# EAGLE design Soil Power Sensor (EAGLE 9.6.2)
REVISION: 2.0.0-a.6

## Sheet 1 of 4
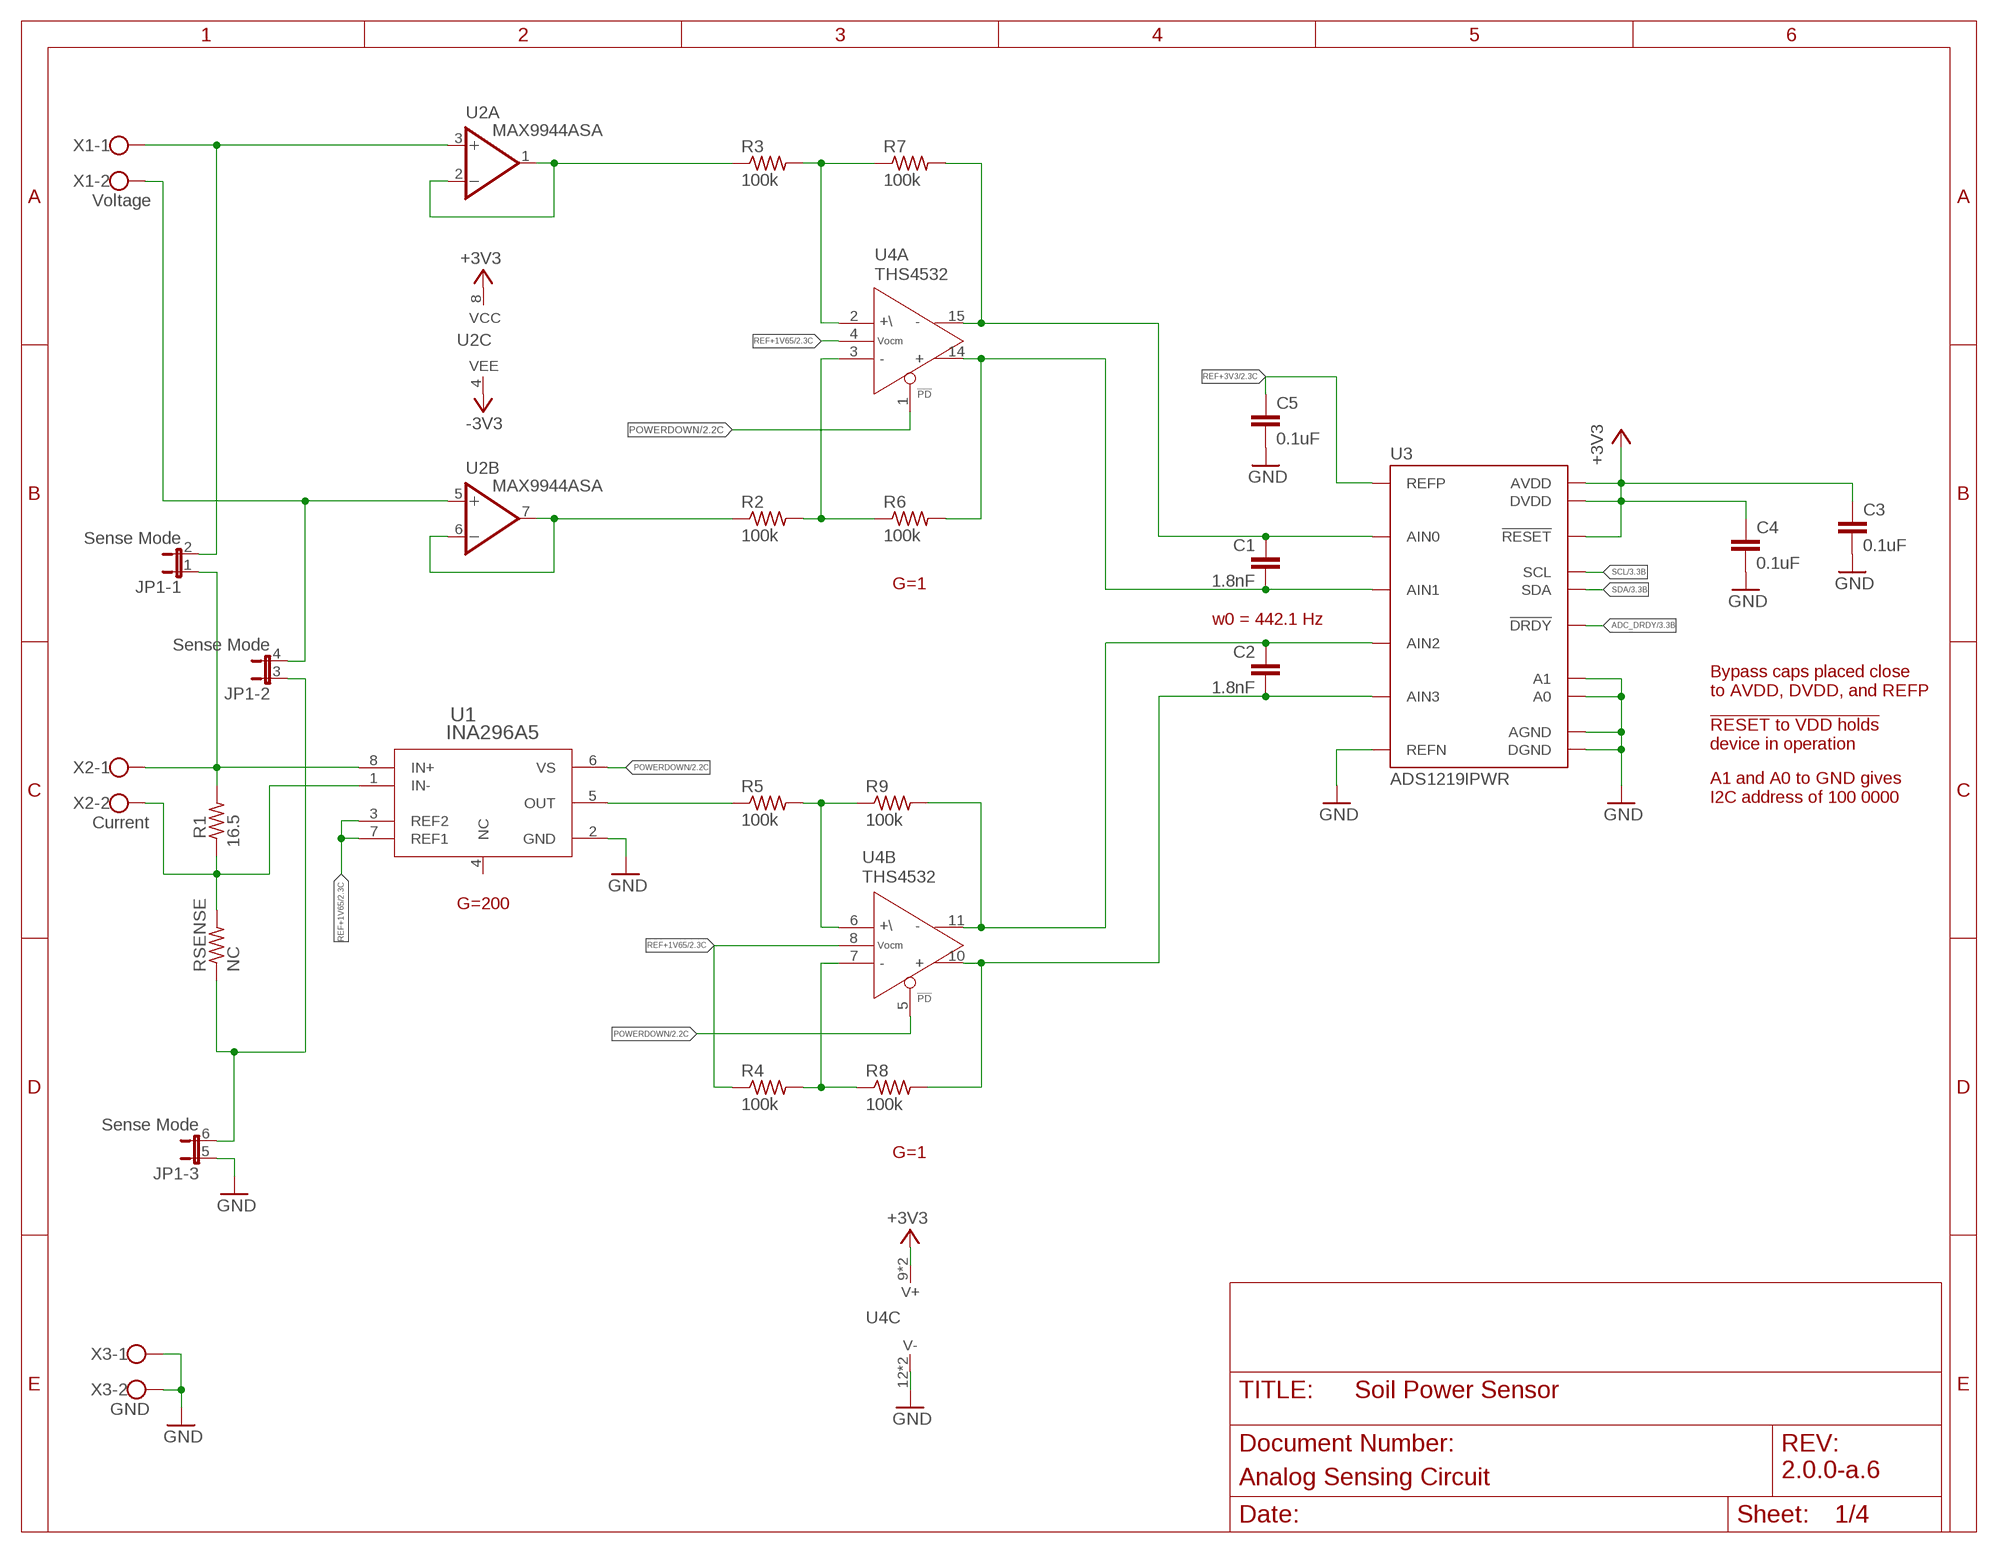
[diagram p0: schematic, sheet 1]

### Parts
C1  1.8nF  C-EUC0603  [C0603]
C2  1.8nF  C-EUC0603  [C0603]
C3  0.1uF  C-EUC0603  [C0603]
C4  0.1uF  C-EUC0603  [C0603]
C5  0.1uF  C-EUC0603  [C0603]
JP1  Sense Mode  JP3QE  [JP3Q]
R1  16.5  R-US_R0603  [R0603]
R2  100k  R-US_R0603  [R0603]
R3  100k  R-US_R0603  [R0603]
R4  100k  R-US_R0603  [R0603]
R5  100k  R-US_R0603  [R0603]
R6  100k  R-US_R0603  [R0603]
R7  100k  R-US_R0603  [R0603]
R8  100k  R-US_R0603  [R0603]
R9  100k  R-US_R0603  [R0603]
RSENSE  NC  R-US_R0603  [R0603]
U1  INA296A5  [SOT65P280X110-8N]
U2  MAX9944ASA  [SOIC127P600X155-8N]
U3  ADS1219IPWR  [TSSOP65P640X120-16]
U4  THS4532  [SOP65P640X120-16N]
X1  Voltage  W237-102  [W237-102]
X2  Current  W237-102  [W237-102]
X3  GND  W237-102  [W237-102]

### Nets
+3V3: C3.1 C4.1 U2.8(C:VCC) U3.PIN3(!RESET) U3.PIN12(AVDD) U3.PIN13(DVDD) U4.9(C:V+) U4.13(C:V+) ; also sheet 2,3,4
-3V3: U2.4(C:VEE) ; also sheet 2
ADC_DRDY: U3.PIN14(!DRDY) ; also sheet 3
CURRENT_N: C2.1 R9.2 U3.PIN7(AIN2) U4.11(B:OUT-)
CURRENT_P: C2.2 R8.2 U3.PIN6(AIN3) U4.10(B:OUT+)
GND: C3.2 C4.2 C5.2 JP1.5 U1.2(GND) U3.PIN1(A0) U3.PIN2(A1) U3.PIN4(DGND) U3.PIN5(AGND) U3.PIN8(REFN) U4.12(C:V-) U4.16(C:V-) X3.1 X3.2 ; also sheet 2,3,4
I+: JP1.1 R1.2 U1.8(IN+) X2.1
I-: R1.1 RSENSE.2 U1.1(IN-) X2.2
N$4: R2.1 U2.6(B:-IN) U2.7(B:OUT)
N$8: R3.1 U2.1(A:OUT) U2.2(A:-IN)
N$29: R3.2 R7.1 U4.2(A:+IN)
N$30: R2.2 R6.1 U4.3(A:-IN)
N$33: R5.2 R9.1 U4.6(B:+IN)
N$36: R4.2 R8.1 U4.7(B:-IN)
N$37: R5.1 U1.5(OUT)
N$48: JP1.3 JP1.6 RSENSE.1
POWERDOWN: U1.6(VS) U4.1(A:!PD) U4.5(B:!PD) ; also sheet 2,3
REF+1V65: R4.1 U1.3(REF2) U1.7(REF1) U4.4(A:VOCM) U4.8(B:VOCM) ; also sheet 2
REF+3V3: C5.1 U3.PIN9(REFP) ; also sheet 2
SCL: U3.PIN16(SCL) ; also sheet 3,4
SDA: U3.PIN15(SDA) ; also sheet 3,4
V+: JP1.2 U2.3(A:+IN) X1.1
V-: JP1.4 U2.5(B:+IN) X1.2
VOLTAGE_N: C1.1 R7.2 U3.PIN11(AIN0) U4.15(A:OUT-)
VOLTAGE_P: C1.2 R6.2 U3.PIN10(AIN1) U4.14(A:OUT+)
Unconnected: U1.4(NC)

### Notes on the sheet
- G=1
- w0 = 442.1 Hz
- Bypass caps placed close
  to AVDD, DVDD, and REFP
- !RESET to VDD holds
  device in operation
- A1 and A0 to GND gives
  I2C address of 100 0000
- G=200
- G=1

## Sheet 2 of 4
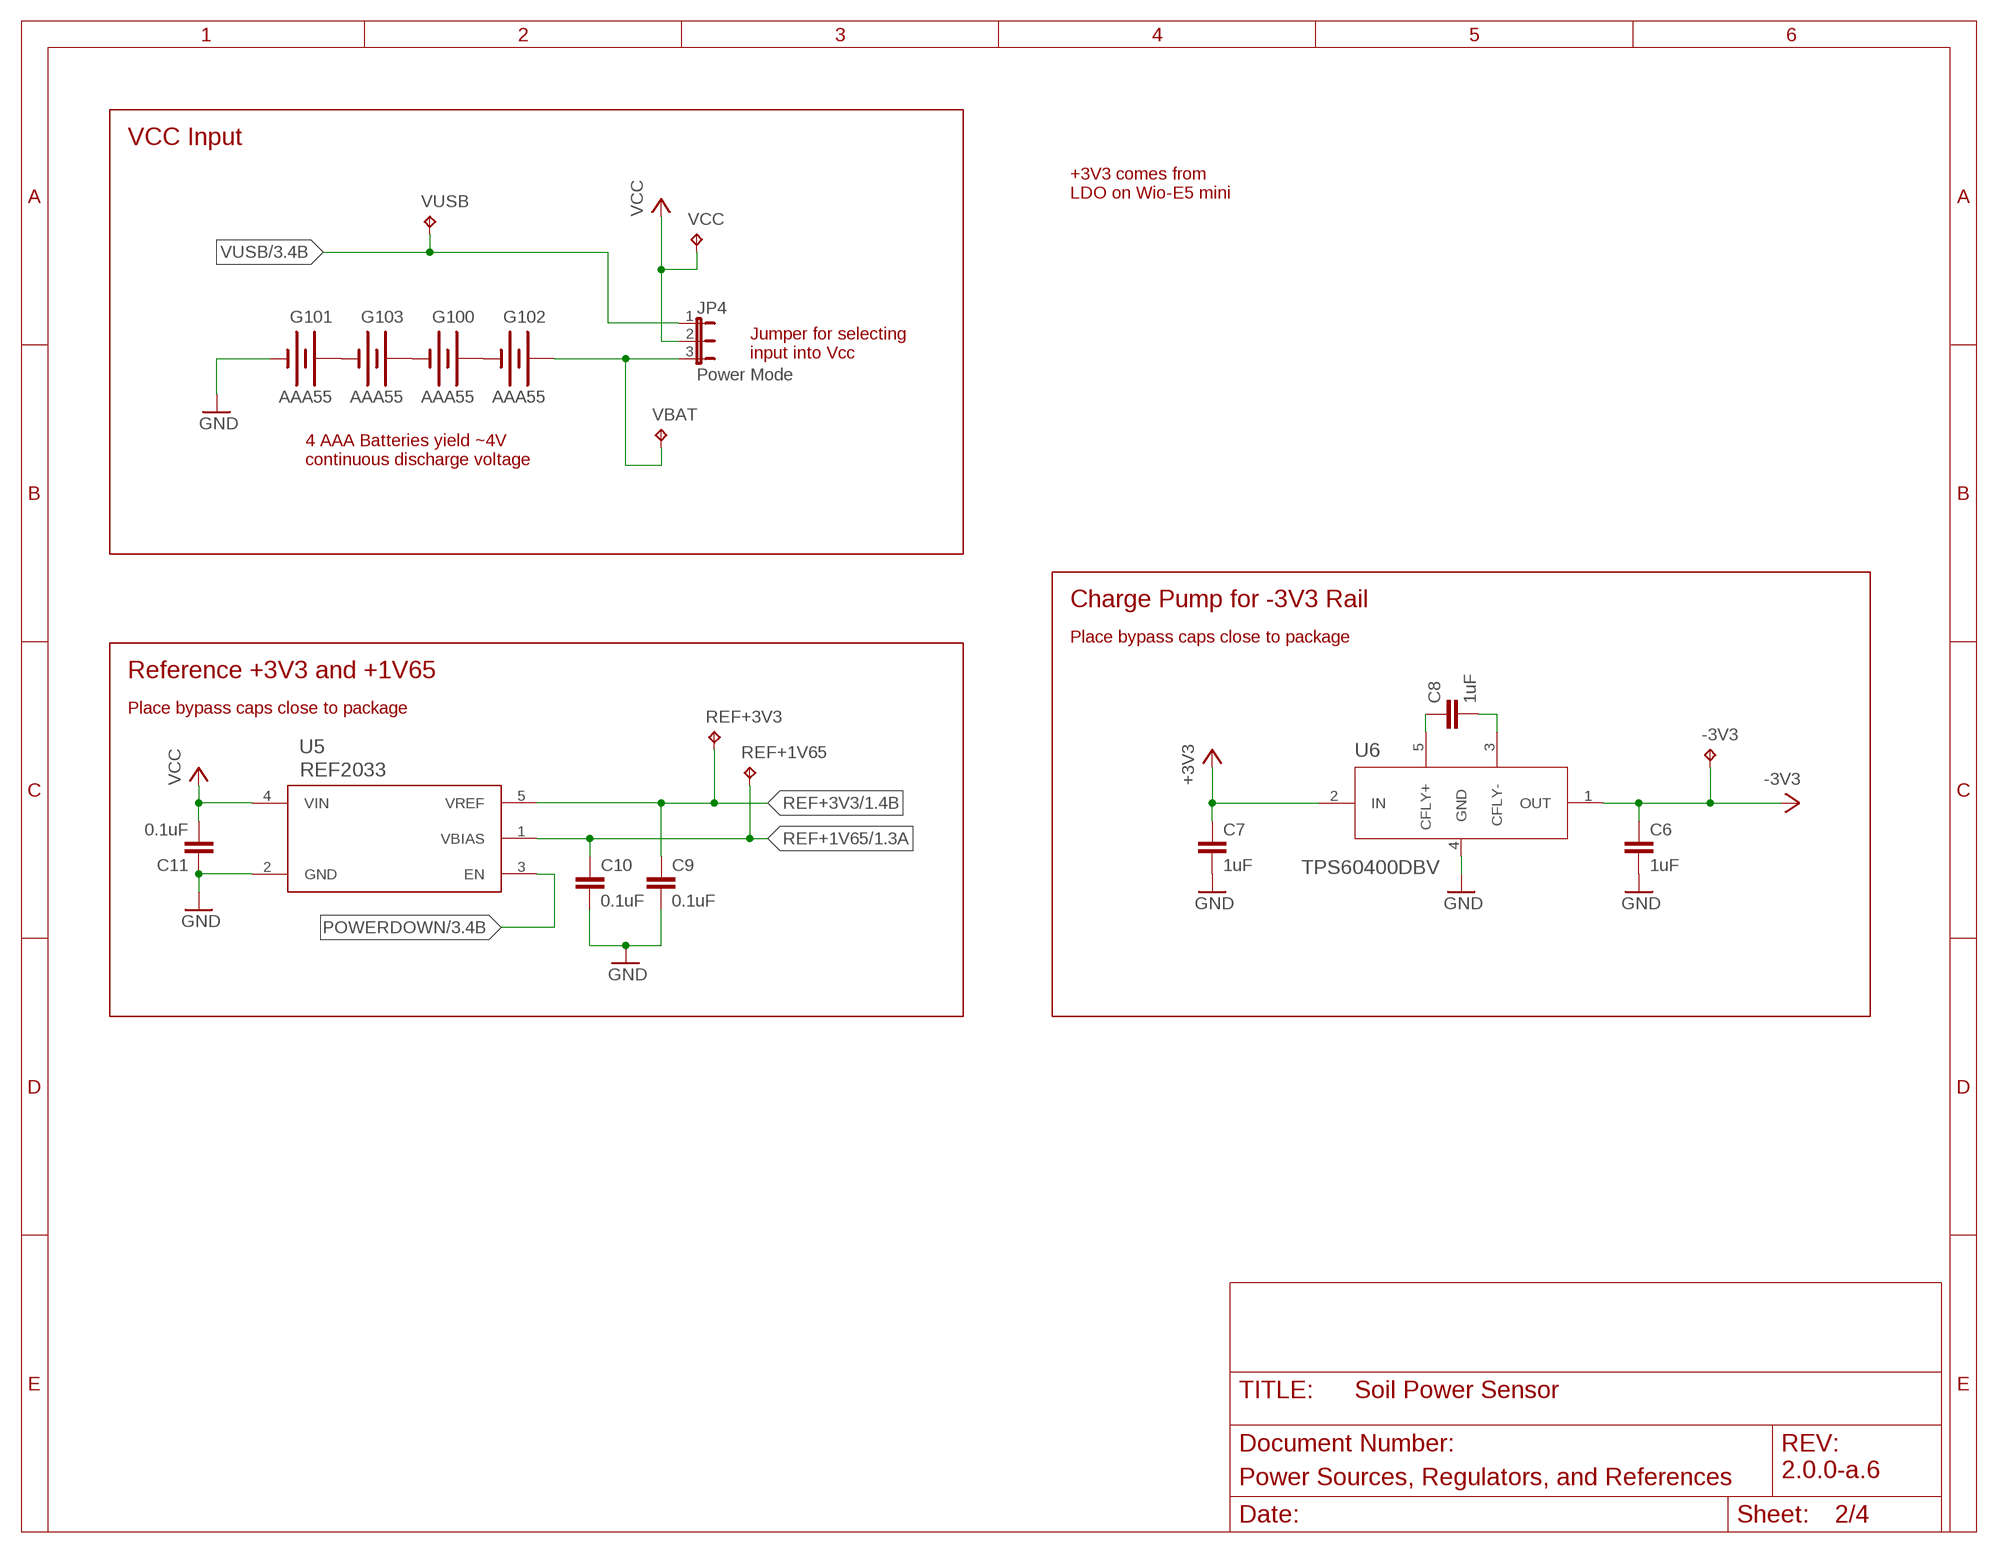
[diagram p1: schematic, sheet 2]

### Parts
-3V3  TPB1,27  [B1,27]
C6  1uF  C-EUC0603  [C0603]
C7  1uF  C-EUC0603  [C0603]
C8  1uF  C-EUC0603  [C0603]
C9  0.1uF  C-EUC0603  [C0603]
C10  0.1uF  C-EUC0603  [C0603]
C11  0.1uF  C-EUC0603  [C0603]
G100  AAA55  [AAA55]
G101  AAA55  [AAA55]
G102  AAA55  [AAA55]
G103  AAA55  [AAA55]
JP4  Power Mode  JP2E  [JP2]
REF+1V65  TPB1,27  [B1,27]
REF+3V3  TPB1,27  [B1,27]
U5  REF2033  [SOT95P280X110-5N]
U6  TPS60400DBV  [SOT95P280X145-5N]
VBAT  TPB1,27  [B1,27]
VCC  TPB1,27  [B1,27]
VUSB  TPB1,27  [B1,27]

### Nets
+3V3: C7.1 U6.2(IN) ; also sheet 1,3,4
-3V3: -3V3.TP C6.1 U6.1(OUT) ; also sheet 1
GND: C6.2 C7.2 C9.2 C10.2 C11.1 G101.N1(-) G101.N2(-) U5.2(GND) U6.4(GND) ; also sheet 1,3,4
N$7: C8.1 U6.5(CFLY+)
N$10: C8.2 U6.3(CFLY-)
N$16: G100.P1(+) G100.P2(+) G102.N1(-) G102.N2(-)
N$17: G100.N1(-) G100.N2(-) G103.P1(+) G103.P2(+)
N$18: G101.P1(+) G101.P2(+) G103.N1(-) G103.N2(-)
POWERDOWN: U5.3(EN) ; also sheet 1,3
REF+1V65: C10.1 REF+1V65.TP U5.1(VBIAS) ; also sheet 1
REF+3V3: C9.1 REF+3V3.TP U5.5(VREF) ; also sheet 1
VBAT: G102.P1(+) G102.P2(+) JP4.3 VBAT.TP
VCC: C11.2 JP4.2 U5.4(VIN) VCC.TP ; also sheet 3
VUSB: JP4.1 VUSB.TP ; also sheet 3

### Notes on the sheet
- VCC Input
- +3V3 comes from
  LDO on Wio-E5 mini
- Jumper for selecting
  input into Vcc
- 4 AAA Batteries yield ~4V
  continuous discharge voltage
- Charge Pump for -3V3 Rail
- Place bypass caps close to package
- Reference +3V3 and +1V65
- Place bypass caps close to package

## Sheet 3 of 4
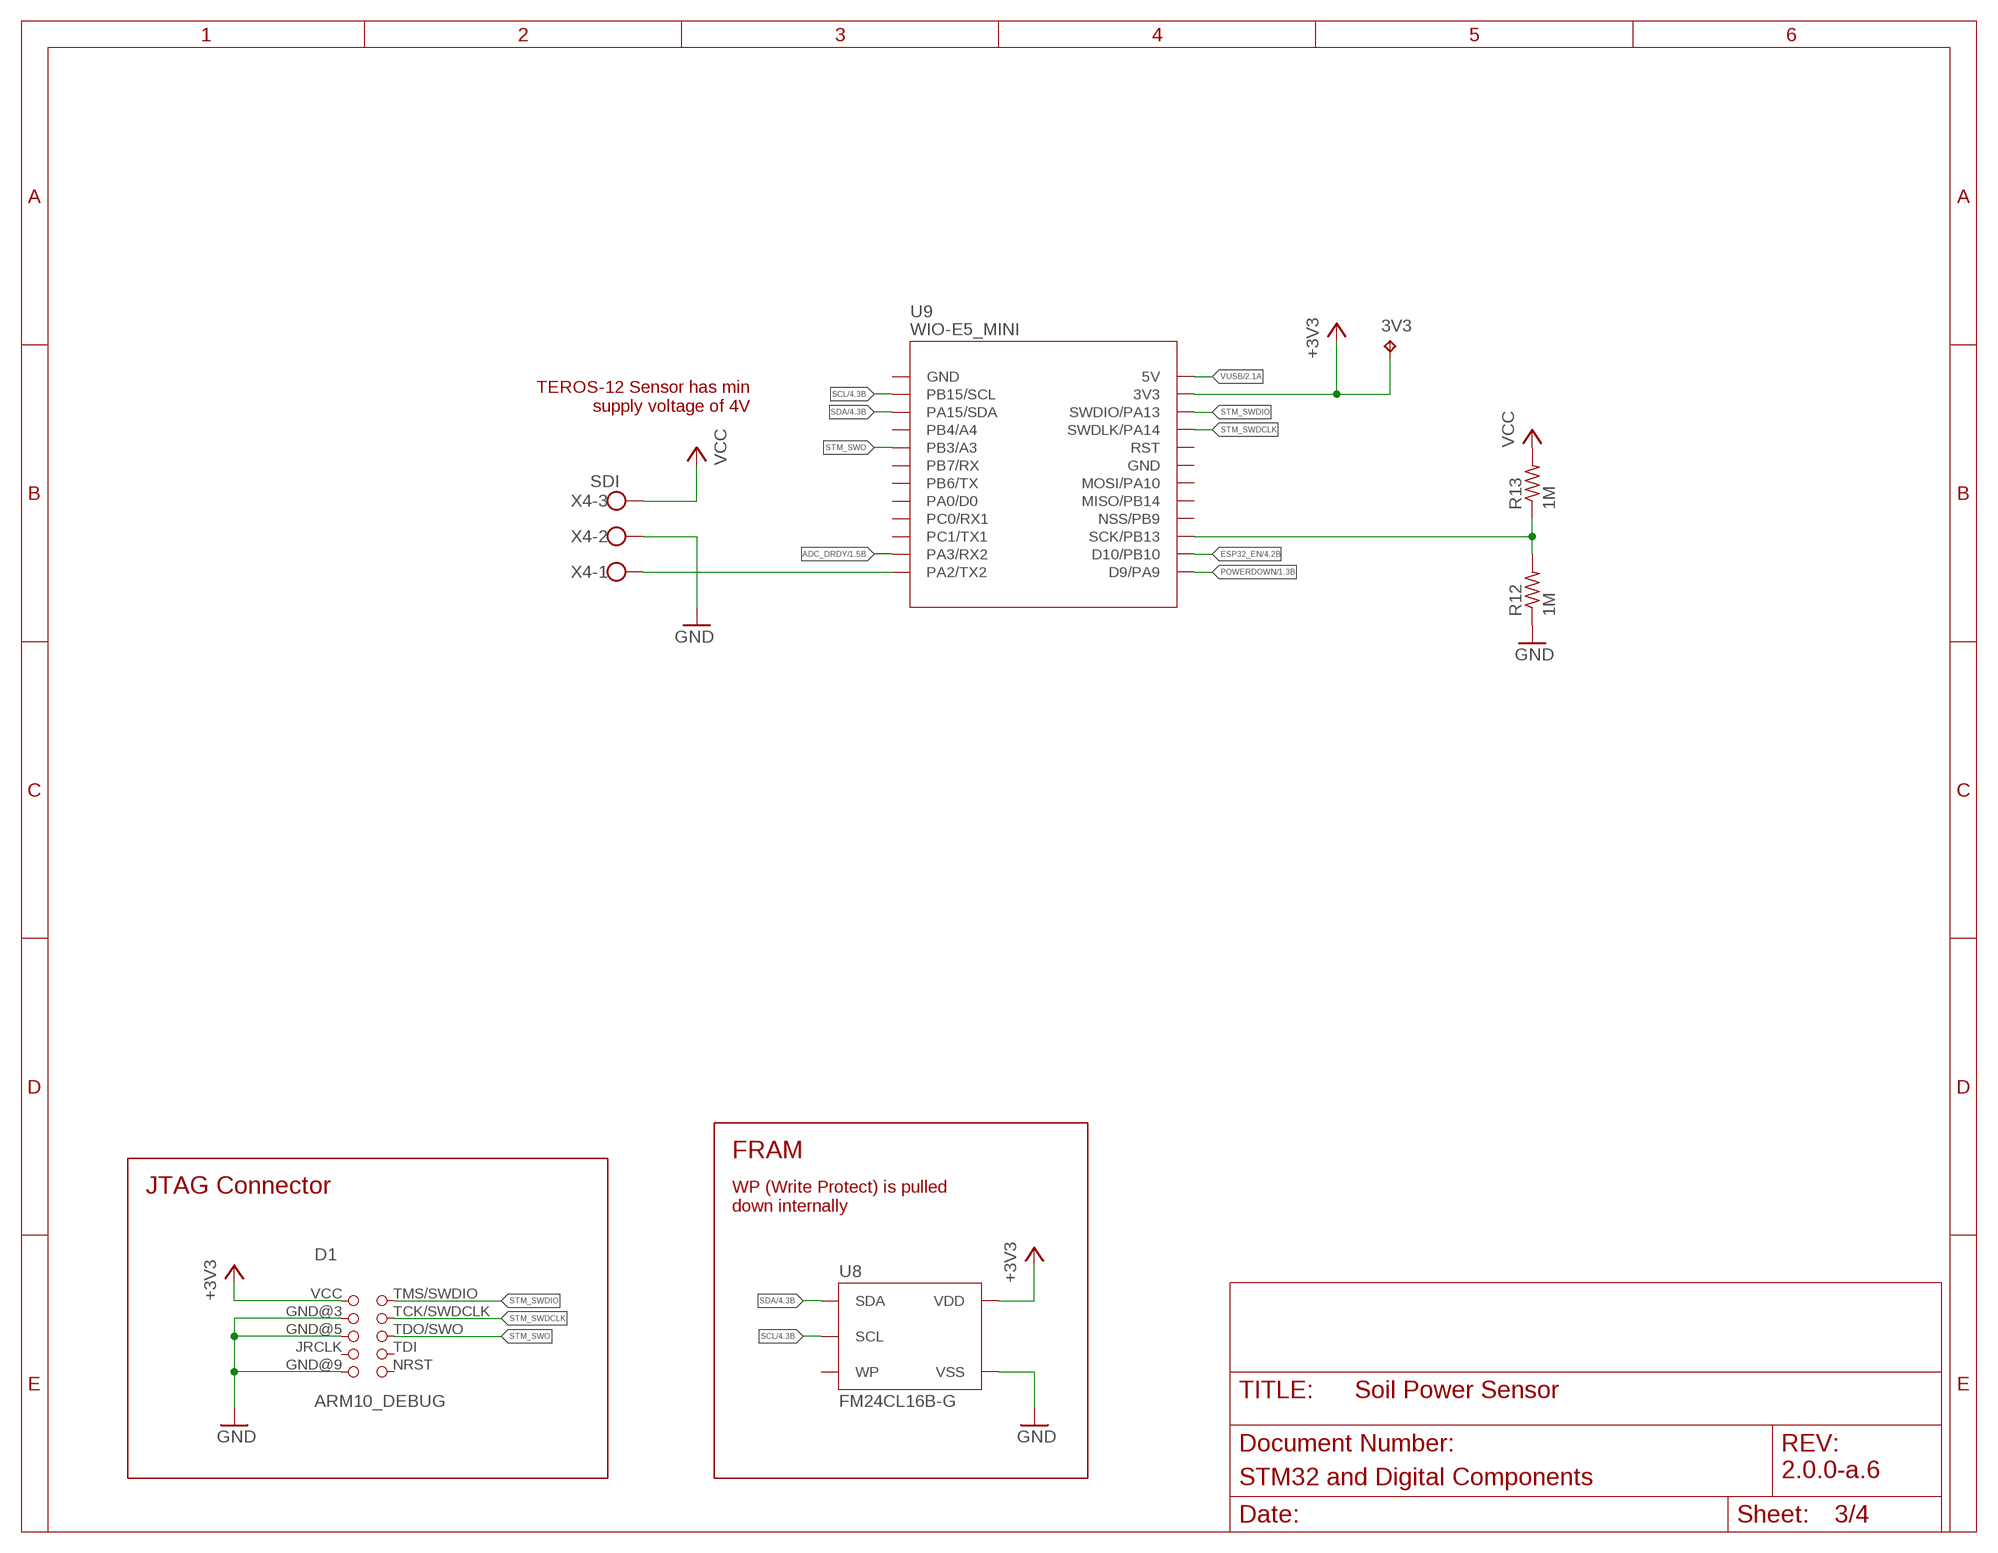
[diagram p2: schematic, sheet 3]

### Parts
3V3  TPB1,27  [B1,27]
D1  ARM10_DEBUG  [ARM10_DEBUG]
R12  1M  R-US_R0603  [R0603]
R13  1M  R-US_R0603  [R0603]
U8  FM24CL16B-G  [SOIC127P602X164-8N]
U9  WIO-E5_MINI  [WIO-E5_MINI]
X4  SDI  W237-103  [W237-103]

### Nets
+3V3: 3V3.TP D1.VCC U8.P8(VDD) U9.P22(3V3) ; also sheet 1,2,4
ADC_DRDY: U9.P10(PA3/RX2) ; also sheet 1
ESP32_EN: U9.P13(D10/PB10) ; also sheet 4
GND: D1.GND@3 D1.GND@5 D1.GND@9 R12.1 U8.P4(VSS) X4.2 ; also sheet 1,2,4
POWERDOWN: U9.P12(D9/PA9) ; also sheet 1,2
SCL: U8.P6(SCL) U9.P1(PB15/SCL) ; also sheet 1,4
SDA: U8.P5(SDA) U9.P2(PA15/SDA) ; also sheet 1,4
SDI_DATA: U9.P11(PA2/TX2) X4.1
STM_SWDCLK: D1.TCK/SWDCLK U9.P20(SWDLK/PA14)
STM_SWDIO: D1.TMS/SWDIO U9.P21(SWDIO/PA13)
STM_SWO: D1.TDO/SWO U9.P4(PB3/A3)
VBAT/2: R12.2 R13.1 U9.P14(SCK/PB13)
VCC: R13.2 X4.3 ; also sheet 2
VUSB: U9.P23(5V) ; also sheet 2
Unconnected: D1.JRCLK D1.NRST D1.TDI U8.P7(WP) U9.P3(PB4/A4) U9.P5(PB7/RX) U9.P6(PB6/TX) U9.P7(PA0/D0) U9.P8(PC0/RX1) U9.P9(PC1/TX1) U9.P15(NSS/PB9) U9.P16(MISO/PB14) U9.P17(MOSI/PA10) U9.P19(RST)

### Notes on the sheet
- TEROS-12 Sensor has min
  supply voltage of 4V
- FRAM
- JTAG Connector
- WP (Write Protect) is pulled
  down internally

## Sheet 4 of 4
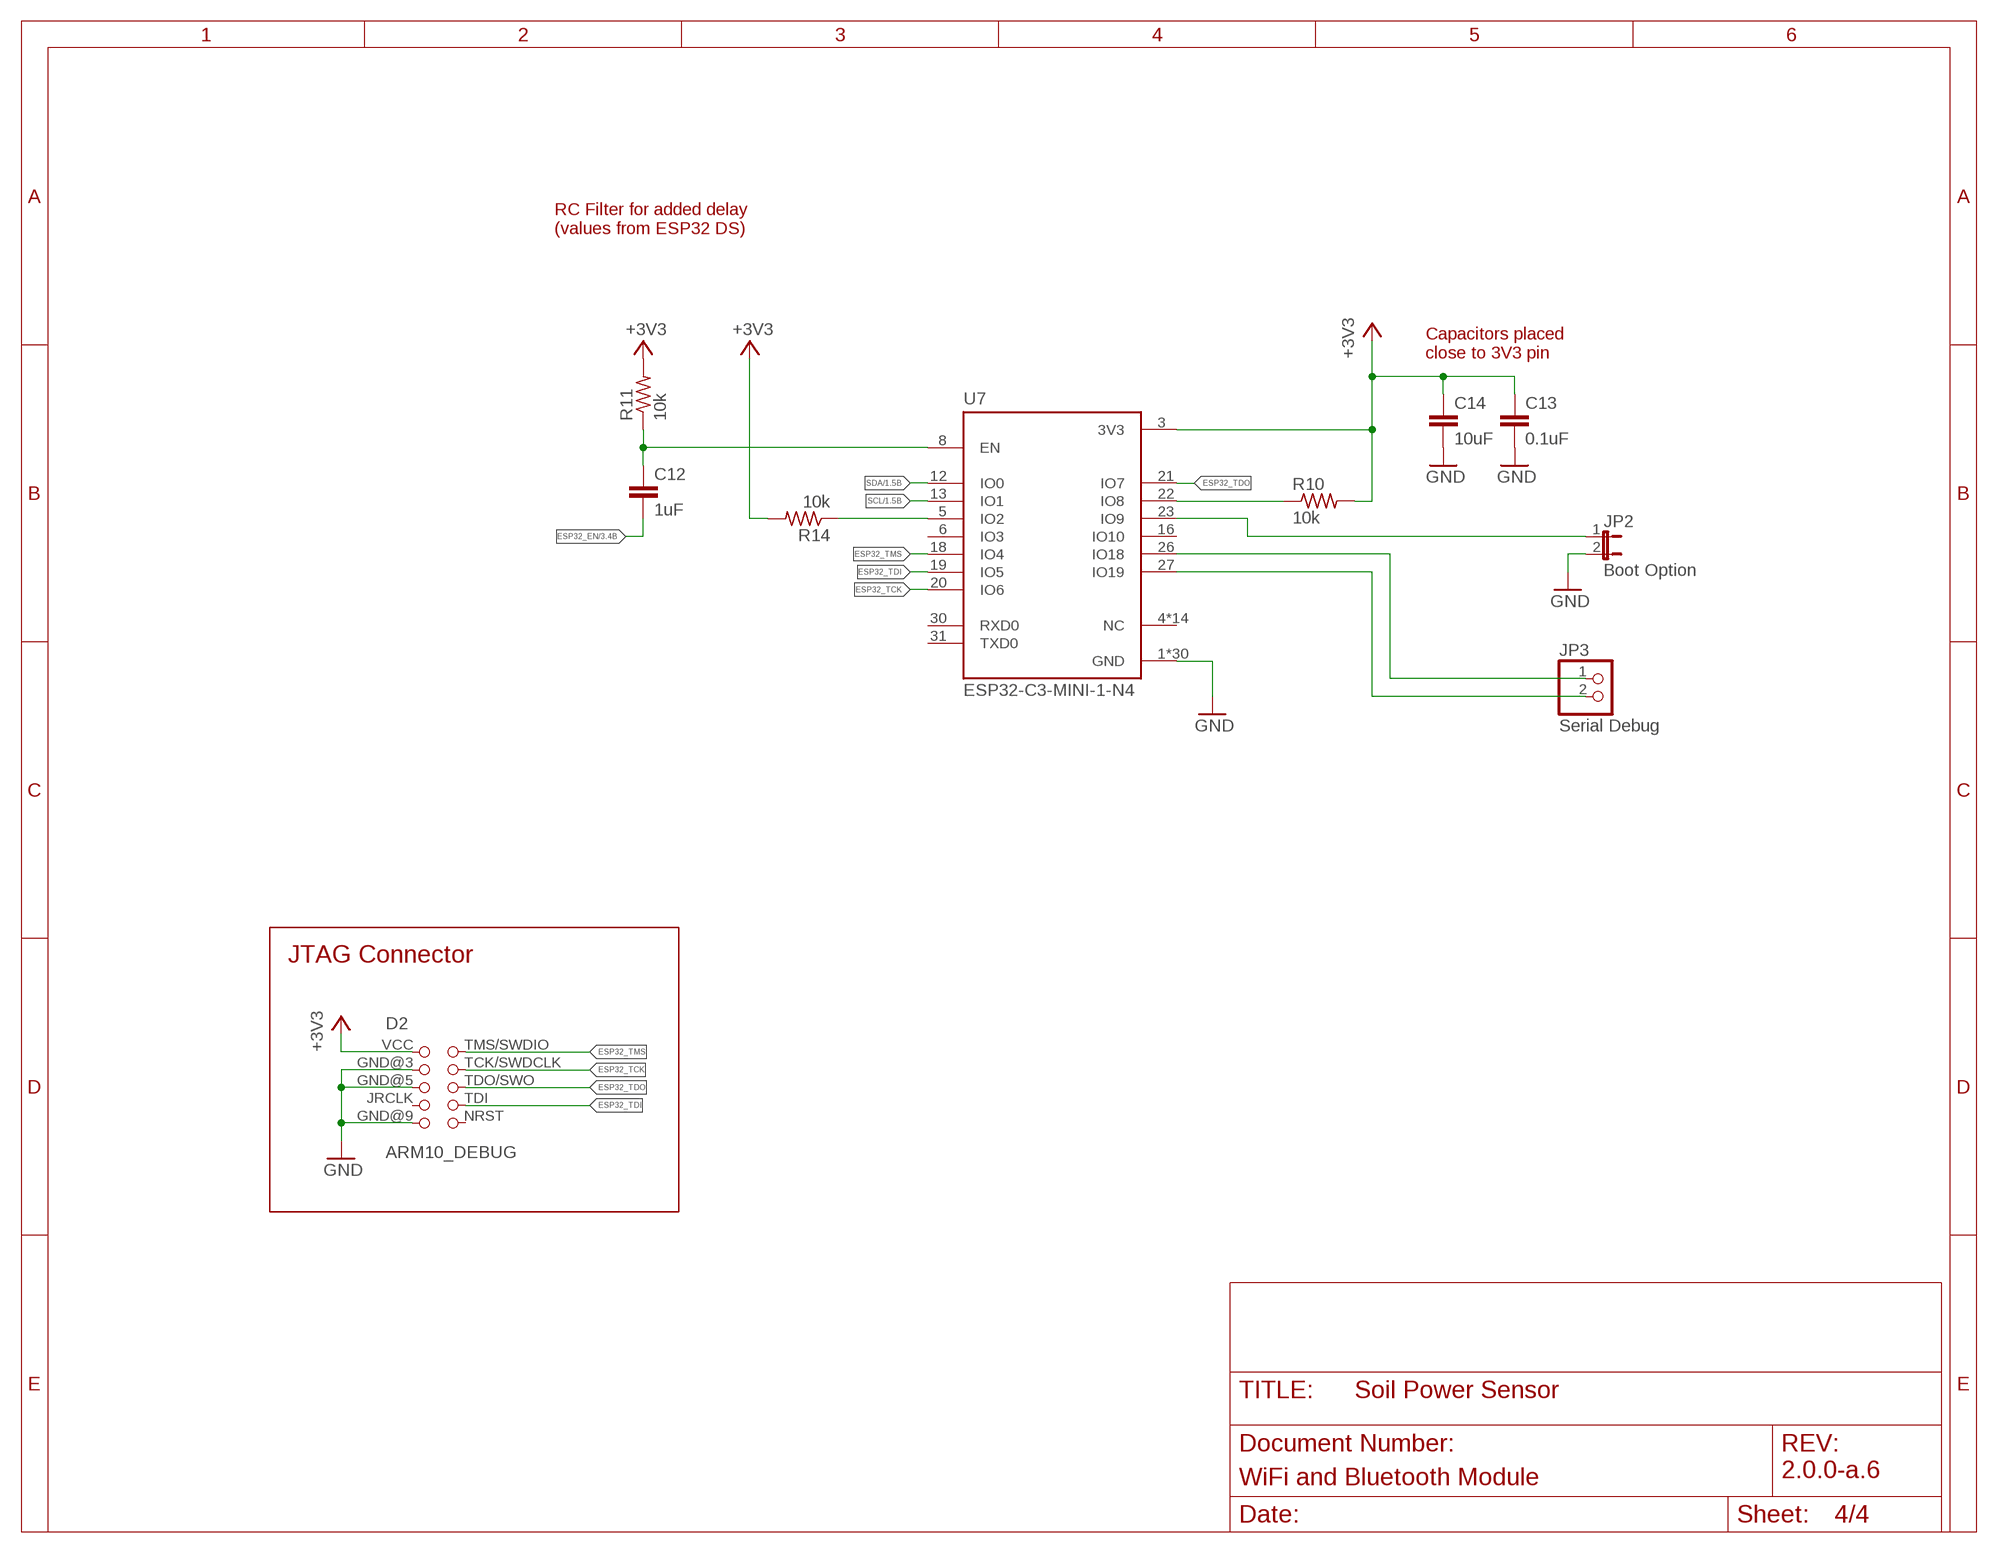
[diagram p3: schematic, sheet 4]

### Parts
C12  1uF  C-EUC0603  [C0603]
C13  0.1uF  C-EUC0603  [C0603]
C14  10uF  C-EUC0603  [C0603]
D2  ARM10_DEBUG  [ARM10_DEBUG]
JP2  Boot Option  JP1E  [JP1]
JP3  Serial Debug  PINHD-1X2  [1X02]
R10  10k  R-US_R0603  [R0603]
R11  10k  R-US_R0603  [R0603]
R14  10k  R-US_R0603  [R0603]
U7  ESP32-C3-MINI-1-N4  [XCVR_ESP32-C3-MINI-1-N4]

### Nets
+3V3: C13.1 C14.1 D2.VCC R10.2 R11.2 R14.2 U7.3(3V3) ; also sheet 1,2,3
D+: JP3.1 U7.26(IO18)
D-: JP3.2 U7.27(IO19)
ESP32_EN: C12.2 ; also sheet 3
ESP32_TCK: D2.TCK/SWDCLK U7.20(IO6)
ESP32_TDI: D2.TDI U7.19(IO5)
ESP32_TDO: D2.TDO/SWO U7.21(IO7)
ESP32_TMS: D2.TMS/SWDIO U7.18(IO4)
GND: C13.2 C14.2 D2.GND@3 D2.GND@5 D2.GND@9 JP2.2 U7.1(GND) U7.2(GND) U7.11(GND) U7.14(GND) U7.36(GND) U7.37(GND) U7.38(GND) U7.39(GND) U7.40(GND) U7.41(GND) U7.42(GND) U7.43(GND) U7.44(GND) U7.45(GND) U7.46(GND) U7.47(GND) U7.48(GND) U7.49_1(GND) U7.49_2(GND) U7.49_3(GND) U7.49_4(GND) U7.49_5(GND) U7.49_6(GND) U7.49_7(GND) U7.49_8(GND) U7.49_9(GND) U7.50(GND) U7.51(GND) U7.52(GND) U7.53(GND) ; also sheet 1,2,3
IO9/BOOT: JP2.1 U7.23(IO9)
N$21: R10.1 U7.22(IO8)
N$24: C12.1 R11.1 U7.8(EN)
N$25: R14.1 U7.5(IO2)
SCL: U7.13(IO1) ; also sheet 1,3
SDA: U7.12(IO0) ; also sheet 1,3
Unconnected: D2.JRCLK D2.NRST U7.4(NC) U7.6(IO3) U7.7(NC) U7.9(NC) U7.10(NC) U7.15(NC) U7.16(IO10) U7.17(NC) U7.24(NC) U7.25(NC) U7.28(NC) U7.29(NC) U7.30(RXD0) U7.31(TXD0) U7.32(NC) U7.33(NC) U7.34(NC) U7.35(NC)

### Notes on the sheet
- RC Filter for added delay
  (values from ESP32 DS)
- Capacitors placed
  close to 3V3 pin
- JTAG Connector

## Power pins joined to a net without a drawn wire
GND: U9.P0(GND) U9.P18(GND)

## Library data of the parts
3V3 -3V3 REF+1V65 REF+3V3 VBAT VCC VUSB = testpad:TP: Test pad
C1 = rcl:C-EU: CAPACITOR, European symbol; MPN: CC0603FRNPO9BN270; SPICEPREFIX: C
C2 = rcl:C-EU: CAPACITOR, European symbol; MPN: CC0603FRNPO9BN220; SPICEPREFIX: C
C3-C8 = rcl:C-EU: CAPACITOR, European symbol; SPICEPREFIX: C
C9-C11 C13 = rcl:C-EU: CAPACITOR, European symbol; MPN: CC0603KPX7R7BB104; SPICEPREFIX: C
C12 = rcl:C-EU: CAPACITOR, European symbol; MPN: CC0603KRX5R7BB105; SPICEPREFIX: C
C14 = rcl:C-EU: CAPACITOR, European symbol; MPN: CC0603KRX5R5BB106; SPICEPREFIX: C
D1 D2 = Soil Power Sensor:ARM10_DEBUG: Connector Header Surface Mount 10 position 0.050" (1.27mm); AUTHOR: John Madden <jmadden173@pm.me>; DATE_CREATED: 2023-08-25; DATE_MODIFIED: 2023-08-25; MFC: CNC Tech; MPN: 3220-10-0300-00; REF: https://www.cnctech.us/pdfs/3220-XX-0300-00_.pdf
G100-G103 = Soil Power Sensor:AAA55: AAA Battery Holder using Keystone 55 clips; AUTHOR: John Madden <jmadden173@pm.me>; DATE_CREATED: 2023-04-04; DATE_MODIFIED: 2023-04-04; MFC: Keystone; MPN: 55; QTY: 2; REF: https://www.keyelco.com/product.cfm/product_id/812
JP1 = jumper:JP3QE: JUMPER
JP2 = jumper:JP1E: JUMPER
JP3 = pinhead:PINHD-1X2: PIN HEADER
JP4 = jumper:JP2E: JUMPER
R1 = rcl:R-US_: RESISTOR, American symbol; MPN: RC0603FR-0716R5L; SPICEPREFIX: R
R2-R9 = rcl:R-US_: RESISTOR, American symbol; MPN: RT0603BRD07100KL; SPICEPREFIX: R
R10 R11 R14 = rcl:R-US_: RESISTOR, American symbol; MPN: RC0603FR-0710KL; SPICEPREFIX: R
R12 R13 = rcl:R-US_: RESISTOR, American symbol; MPN: RC0603FR-071ML; SPICEPREFIX: R
RSENSE = rcl:R-US_: RESISTOR, American symbol; SPICEPREFIX: R
U1 = Soil Power Sensor:INA296*: -5-V to 110-V, bidirectional, 1.1-MHz 5-V/µs ultraprecise current sense amplifier; AUTHOR: John Madden <jmadden173@pm.me>; DATE_CREATED: 2023-04-05; DATE_MODIFIED: 2023-04-05; GAIN: 200; MFC: TI; MPN: INA296A5IDDFR; QTY: 1; REF: https://www.ti.com/product/INA296A
U2 = Soil Power Sensor:MAX9944: High-Voltage, Precision, Low-Power Op Amps; AUTHOR: John Madden <jmadden173@pm.me>; DATE_CREATED: 2023-04-05; DATE_MODIFIED: 2023-04-05; MFC: Analog Devices; MPN: MAX9944ASA+T; QTY: 1; REF: https://www.analog.com/en/products/max9944.html#product-overview
U3 = Soil Power Sensor:ADS1219?*: 24-bit, 1kSPS, 4-ch general-purpose delta-sigma ADC with I2C interface and external Vref inputs; AUTHOR: John Madden <jmadden173@pm.me>; DATE_CREATED: 2023-09-01; DATE_MODIFIED: 2023-09-01; MFC: TI; MPN: ADS1219IPWR; REF: https://www.ti.com/product/ADS1219
U4 = Soil Power Sensor:THS4532: Dual, Ultra low power 0.25mA, RRO, fully differential amplifier; AUTHOR: John Madden <jmadden173@pm.me>; DATE_CREATED: 2023-04-06; DATE_MODIFIED: 2023-04-06; MFC: TI; MPN: THS4532IPW; REF: https://www.ti.com/product/THS4532
U5 = Soil Power Sensor:REF20*: 3.3-V Vref, low-drift, low-power, dual-output Vref & Vref/2 voltage reference; AUTHOR: John Madden <jmadden173@pm.me>; DATE_CREATED: 2023-04-11; DATE_MODIFIED: 2023-04-11; MFC: TI; MPN: REF2033QDDCRQ1; REF: https://www.ti.com/product/REF2033
U6 = Soil Power Sensor:TPS6040*: Unregulated 60-mA Charge Pump Voltage Inverter; AUTHOR: John Madden <jmadden173@pm.me>; DATE_CREATED: 2023-04-07; DATE_MODIFIED: 2023-04-07; MFC: TI; MPN: TPS60400DBVT; REF: https://www.ti.com/product/TPS60400
U7 = Soil Power Sensor:ESP32-C3-MINI-1-N4: Smallsized 2.4 GHz WiFi (802.11 b/g/n) and Bluetooth ® 5 module Built around ESP32C3 series of SoCs, RISCV singlecore microprocessor 4 MB flash in chip package 15 GPIOs Onboard PCB antenna or external antenna connector.; AUTHOR: SnapEDA; DATE_CREATED: 2023-04-04; DATE_MODIFIED: 2023-04-04; MFC: Espressif; MPN: ESP32-C3-MINI-1-N4; QTY: 1; REF: https://www.espressif.com/en/products/socs/esp32-c3
U8 = Soil Power Sensor:FM24CL16B*: 16-Kbit (2K × 8) Serial (I2C) F-RAM; AUTHOR: John Madden <jmadden173@pm.me>; DATE_CREATED: 2023-09-11; DATE_MODIFIED: 2023-09-11; MFC: Cypress; MPN: FM24CL16B-G
U9 = Soil Power Sensor:WIO-E5_MINI: Wio-E5 mini is a compacted-sized development board suitable for the rapid testing and building of small-size prototyping and helps you design your ideal LoRaWAN® wireless IoT device with a long-distance transmission range.; AUTHOR: John Madden <jmadden173@pm.me>; DATE_CREATE: 2023-08-23; DATE_MODIFIED: 2023-08-23; MFC: Seeedstudio; MPN: 113990939; REF: https://wiki.seeedstudio.com/LoRa_E5_mini/
X1-X3 = con-wago-500:W237-102: WAGO SCREW CLAMP; MPN: 237-102; OC_FARNELL: unknown; OC_NEWARK: 70K9898
X4 = con-wago-500:W237-103: WAGO SCREW CLAMP; MPN: 237-103; OC_FARNELL: unknown; OC_NEWARK: 18M7116

## Board
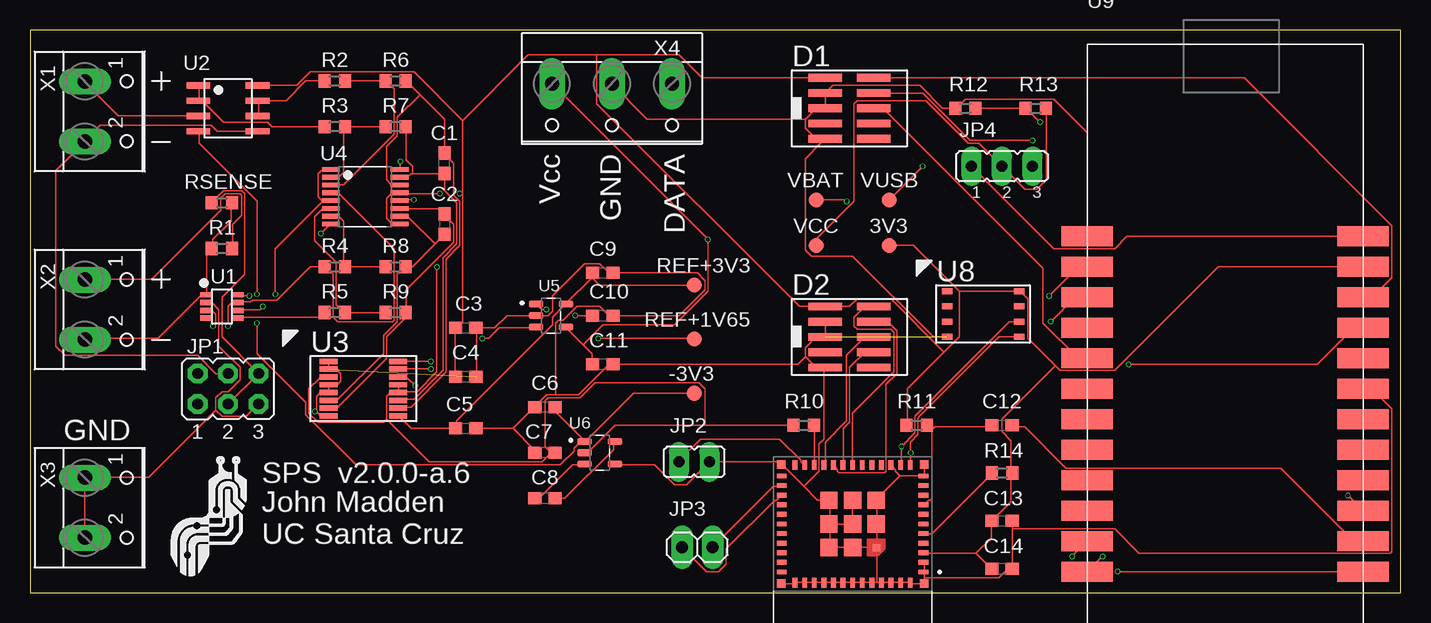
[diagram p4: board, top side]
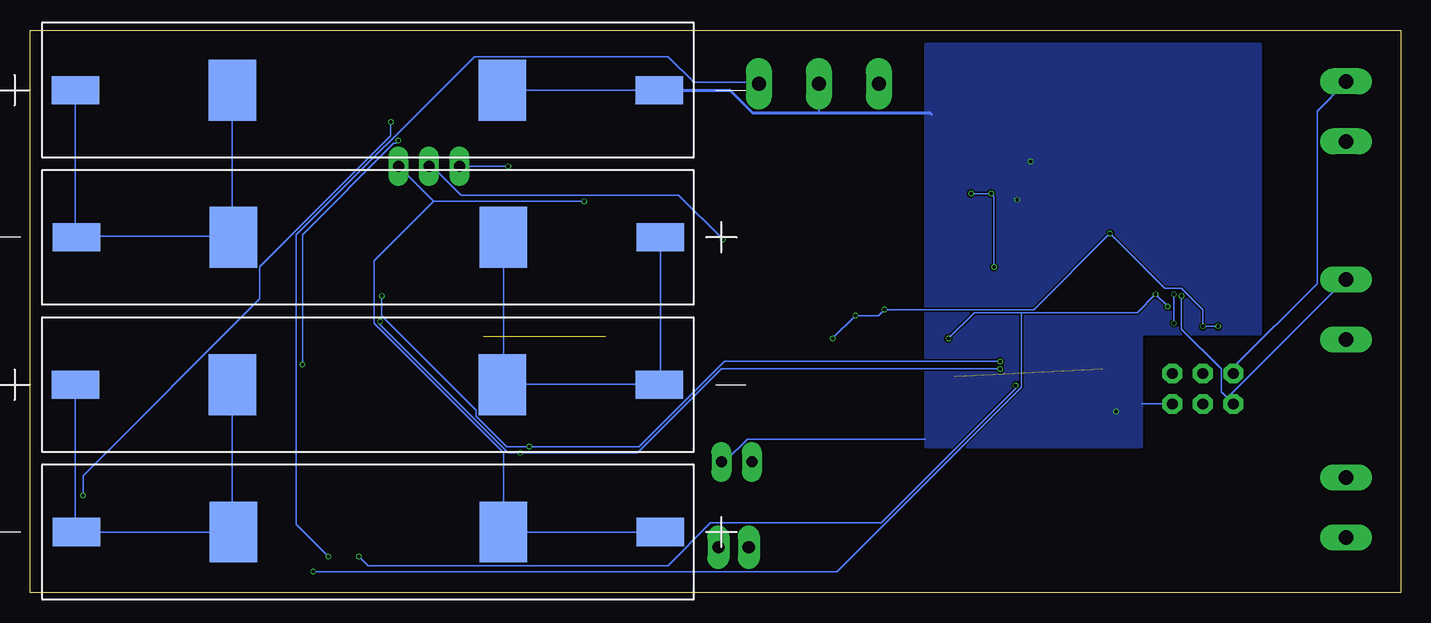
[diagram p5: board, bottom side, seen from below]

Size 114.28 x 46.91 mm. Coordinates in mm from the lower left corner, seen from the top.
Outline: 0,0 114.28,0 114.28,46.91 0,46.91 0,0
Copper layers (1*16): Top 0.035mm / dielectric 1.6mm / Bottom 0.035mm
Design rules "jlcpcb-2layers": minimum track width 5mil, minimum drill 0.3mm, track to track 5mil, track to pad 5mil, pad to pad 5mil, via to via 5mil, smd to smd 5mil, copper to edge 0.2mm, drill to drill 6mil, minimum pad ring 10mil, minimum via ring 3mil, stop-mask expansion 4mil, vias tented up to drill 0mil, thermal gap 10mil

### Footprints (pad centres in the part's own frame; a part is rotated, then mirrored left to right if it is on the bottom)
B1,27 = smd 1.27 x 1.27: TP 0,0
C0603 = smd 1.1 x 1: 1 -0.85,0; 2 0.85,0
ARM10_DEBUG = smd 2.77 x 0.65: GND@3 0,-1.27; GND@5 0,-2.54; GND@9 0,-5.08; JRCLK 0,-3.81; NRST 4.03,-5.08; TCK/SWDCLK 4.03,-1.27; TDI 4.03,-3.81; TDO/SWO 4.03,-2.54; TMS/SWDIO 4.03,0; VCC 0,0
AAA55 = smd 3.962 x 2.337: N1 24.536,0; P1 -24.13,0 | smd 3.962 x 5.08: N2 11.455,0; P2 -11.049,0
JP3Q = drill 0.914 octagon: 1 -2.54,-1.27; 2 -2.54,1.27; 3 0,-1.27; 4 0,1.27; 5 2.54,-1.27; 6 2.54,1.27
JP1 = drill 0.914 long: 1 0,-1.27; 2 0,1.27
1X02 = drill 1.016 long: 1 -1.27,0; 2 1.27,0
JP2 = drill 0.914 long: 1 -2.54,0; 2 0,0; 3 2.54,0
R0603 = smd 1 x 1.1: 1 -0.85,0; 2 0.85,0
SOT65P280X110-8N = smd 1.05 x 0.45: 1 -1.3,0.975; 2 -1.3,0.325; 3 -1.3,-0.325; 4 -1.3,-0.975; 5 1.3,-0.975; 6 1.3,-0.325; 7 1.3,0.325; 8 1.3,0.975
SOIC127P600X155-8N = smd 1.98 x 0.53: 1 -2.465,1.905; 2 -2.465,0.635; 3 -2.465,-0.635; 4 -2.465,-1.905; 5 2.465,-1.905; 6 2.465,-0.635; 7 2.465,0.635; 8 2.465,1.905
TSSOP65P640X120-16 = smd 1.5 x 0.45: PIN1 0,0; PIN2 0,-0.65; PIN3 0,-1.3; PIN4 0,-1.95; PIN5 0,-2.6; PIN6 0,-3.25; PIN7 0,-3.9; PIN8 0,-4.55; PIN9 5.8,-4.55; PIN10 5.8,-3.9; PIN11 5.8,-3.25; PIN12 5.8,-2.6; PIN13 5.8,-1.95; PIN14 5.8,-1.3; PIN15 5.8,-0.65; PIN16 5.8,0
SOP65P640X120-16N = smd 1.57 x 0.41: 1 -2.87,2.275; 2 -2.87,1.625; 3 -2.87,0.975; 4 -2.87,0.325; 5 -2.87,-0.325; 6 -2.87,-0.975; 7 -2.87,-1.625; 8 -2.87,-2.275; 9 2.87,-2.275; 10 2.87,-1.625; 11 2.87,-0.975; 12 2.87,-0.325; 13 2.87,0.325; 14 2.87,0.975; 15 2.87,1.625; 16 2.87,2.275
SOT95P280X110-5N = smd 1.21 x 0.59: 1 -1.255,0.95; 2 -1.255,0; 3 -1.255,-0.95; 4 1.255,-0.95; 5 1.255,0.95
SOT95P280X145-5N = smd 1.21 x 0.59: 1 -1.255,0.95; 2 -1.255,0; 3 -1.255,-0.95; 4 1.255,-0.95; 5 1.255,0.95
XCVR_ESP32-C3-MINI-1-N4 = smd 0.8 x 0.4: 1 -5.9,1.3; 2 -5.9,0.5; 3 -5.9,-0.3; 4 -5.9,-1.1; 5 -5.9,-1.9; 6 -5.9,-2.7; 7 -5.9,-3.5; 8 -5.9,-4.3; 9 -5.9,-5.1; 10 -5.9,-5.9; 11 -5.9,-6.7; 25 5.9,-6.7; 26 5.9,-5.9; 27 5.9,-5.1; 28 5.9,-4.3; 29 5.9,-3.5; 30 5.9,-2.7; 31 5.9,-1.9; 32 5.9,-1.1; 33 5.9,-0.3; 34 5.9,0.5; 35 5.9,1.3 | smd 0.4 x 0.8: 12 -4.8,-7.6; 13 -4,-7.6; 14 -3.2,-7.6; 15 -2.4,-7.6; 16 -1.6,-7.6; 17 -0.8,-7.6; 18 0,-7.6; 19 0.8,-7.6; 20 1.6,-7.6; 21 2.4,-7.6; 22 3.2,-7.6; 23 4,-7.6; 24 4.8,-7.6; 36 4.8,2.2; 37 4,2.2; 38 3.2,2.2; 39 2.4,2.2; 40 1.6,2.2; 41 0.8,2.2; 42 0,2.2; 43 -0.8,2.2; 44 -1.6,2.2; 45 -2.4,2.2; 46 -3.2,2.2; 47 -4,2.2; 48 -4.8,2.2 | smd 0.6 x 0.6: 49_1 -1.975,-0.725 | smd 1.45 x 1.45: 49_2 0,-0.725; 49_3 1.975,-0.725; 49_4 1.975,-2.7; 49_5 1.975,-4.675; 49_6 0,-4.675; 49_7 -1.975,-4.675; 49_8 -1.975,-2.7; 49_9 0,-2.7 | smd 0.7 x 0.7: 50 5.95,2.25; 51 5.95,-7.65; 52 -5.95,-7.65; 53 -5.95,2.25
SOIC127P602X164-8N = smd 0.9 x 0.5: P1 0,0; P2 0,-1.27; P3 0,-2.54; P4 0,-3.81; P5 6,-3.81; P6 6,-2.54; P7 6,-1.27; P8 6,0
WIO-E5_MINI = smd 4.3 x 1.65: P0 0,0; P1 0,-2.54; P2 0,-5.08; P3 0,-7.62; P4 0,-10.16; P5 0,-12.7; P6 0,-15.24; P7 0,-17.78; P8 0,-20.32; P9 0,-22.86; P10 0,-25.4; P11 0,-27.94; P12 23,-27.94; P13 23,-25.4; P14 23,-22.86; P15 23,-20.32; P16 23,-17.78; P17 23,-15.24; P18 23,-12.7; P19 23,-10.16; P20 23,-7.62; P21 23,-5.08; P22 23,-2.54; P23 23,0
W237-102 = drill 1.194 long: 1 -2.5,-1.27; 2 2.5,-1.27
W237-103 = drill 1.194 long: 1 -5,-1.29; 2 0,-1.29; 3 5,-1.29

### Placement (x,y rotation side)
3V3  71.63,28.96 0 top
-3V3  55.37,16.64 180 top
C1  34.54,35.81 90 top
C2  34.54,30.73 270 top
C3  36.32,22.1 0 top
C4  36.32,18.03 0 top
C5  36.32,13.72 0 top
C6  42.93,15.49 180 top
C7  42.93,11.68 180 top
C8  42.93,7.87 180 top
C9  47.75,26.67 0 top
C10  47.75,23.11 0 top
C11  47.75,19.05 180 top
C12  81.03,13.97 0 top
C13  81.03,6.01 0 top
C14  81.03,2.03 0 top
D1  66.29,42.93 0 top
D2  66.29,23.88 0 top
G100  86.36,17.36 0 bottom
G101  86.36,41.91 0 bottom
G102  85.85,5.08 180 bottom
G103  85.85,29.63 180 bottom
JP1  16.51,17.02 0 top
JP2  55.37,10.92 270 top
JP3  55.63,3.81 180 top
JP4  81.03,35.56 0 top
R1  16,28.7 0 top
R2  25.4,42.67 0 top
R3  25.4,38.86 0 top
R4  25.4,27.18 0 top
R5  25.4,23.37 0 top
R6  30.48,42.67 0 top
R7  30.48,38.86 0 top
R8  30.48,27.18 0 top
R9  30.48,23.37 0 top
R10  64.52,13.97 180 top
R11  73.91,13.97 180 top
R12  77.98,40.39 0 top
R13  83.82,40.39 0 top
R14  81.03,9.99 0 top
REF+1V65  55.37,21.15 0 top
REF+3V3  55.37,25.65 0 top
RSENSE  16,32.51 0 top
U1  16,23.88 0 top
U2  16.51,40.39 0 top
U3  24.89,19.3 0 top
U4  27.94,33.02 0 top
U5  43.43,23.11 0 top
U6  47.5,11.68 0 top
U7  68.58,3.05 180 top
U8  76.45,25.15 0 top
U9  88.14,29.72 0 top
VBAT  65.53,32.77 0 top
VCC  65.53,28.96 0 top
VUSB  71.63,32.77 0 top
X1  5.84,40.13 270 top
X2  5.84,23.62 270 top
X3  5.84,7.11 270 top
X4  48.51,41.15 180 top

### Tracks (layer width: path | path; a pad name or v marks a point on that pad's centre or on a via)
+3V3  (via drill 0.3)
  Top 0.127: 78.87,3.3 74.55,3.3 U7.3 | 78.87,3.3 80.14,2.03 C14.1 | 78.87,3.3 80.14,4.57 80.14,5.97 C13.1 80.26,6.1 81.79,7.62 81.79,9.91 R14.2 81.79,10.03 81.79,12.7 81.03,13.46 81.03,14.48 85.47,18.92 | 77.47,25.15 U8.P8 82.55,25.15 83.19,24.51 83.19,21.21 85.47,18.92 | 77.47,25.15 73.66,28.96 3V3.TP | 76.2,20.07 77.47,21.34 77.47,25.15 | 76.2,20.07 73.15,17.02 73.15,13.97 R11.2 | 76.2,20.07 71.75,24.51 68.96,24.51 68.33,23.88 D2.VCC 64.14,23.88 47.24,40.77 47.24,44.83 | U9.P22 99.06,27.18 90.42,18.54 85.85,18.54 85.47,18.92 | 56.26,13.97 48.77,13.97 46.48,11.68 U6.2 | 56.26,13.97 R10.2 | 43.43,11.68 C7.1 43.69,11.68 | 43.43,11.68 42.67,10.92 33.27,10.92 29.72,14.48 | 29.72,14.48 29.72,16.38 29.97,16.64 30.61,16.64 U3.PIN12 30.73,16.76 | 29.72,14.48 29.46,14.22 24,14.22 23.24,14.99 23.24,17.02 24.13,17.91 24.89,17.91 U3.PIN3 | 30.73,16.76 30.73,17.27 U3.PIN13 | 56.26,13.97 56.26,17.02 55.75,17.53 47.12,17.53 45.85,16.26 43.18,16.26 42.93,16 42.93,12.19 43.43,11.68 | U4.9 30.73,30.86 30.1,30.86 29.72,31.24 29.72,32.89 30.1,33.27 30.73,33.27 U4.13 30.86,33.27 v34.16,33.27 | C4.1 35.43,18.03 35.43,22.1 C3.1 35.56,22.1 36.07,22.61 36.07,33.27 | U2.8 22.23,42.29 23.37,43.43 32,43.43 36.07,39.37 | 36.07,33.27 36.07,39.37 | 36.07,33.27 v35.81,33.27 | D1.VCC 56.01,42.93 54.1,44.83 47.24,44.83 | 47.24,44.83 41.53,44.83 36.07,39.37 | 30.73,16.76 32.26,16.76 33.91,18.41 v33.91,27.18
  Bottom 0.127: v35.81,33.27 v34.16,33.27 33.91,33.02 v33.91,27.18
-3V3  (via drill 0.3)
  Top 0.127: 46.1,12.83 46.23,12.7 U6.1 | 46.1,12.83 43.81,15.11 43.81,15.49 C6.1 | -3V3.TP 50.29,16.64 46.35,12.7 U6.1 | v18.92,24.89 18.92,32.64 14.1,37.47 14.1,38.48 U2.4 | v18.92,22.48 18.92,19.94 22.99,15.88 22.99,14.86 27.18,10.67 44.2,10.67 45.34,11.81 45.34,12.06 46.1,12.83 | 46.1,12.83 U6.1
  Bottom 0.127: v18.92,22.48 v18.92,24.89
ADC_DRDY  (via drill 0.3)
  Top 0.127: v32.13,17.27 31.5,17.91 30.73,17.91 U3.PIN14 | U9.P10 v86.87,3.05
  Bottom 0.127: v32.13,17.27 32.13,17.02 43.31,5.84 57.53,5.84 61.09,2.29 86.11,2.29 v86.87,3.05
CURRENT_N
  Top 0.127: U3.PIN7 24.89,15.49 25.65,15.49 29.72,19.56 29.72,21.34 31.24,22.86 31.24,23.37 R9.2 31.37,23.37 31.37,25.27 35.31,29.21 35.31,30.73 34.54,31.5 C2.1 34.54,31.62 34.16,32 30.86,32 U4.11
CURRENT_P
  Top 0.127: 33.78,29.08 34.54,29.84 C2.2 | 33.78,29.08 31.88,27.18 R8.2 31.24,27.18 30.61,26.54 30.61,22.61 29.46,21.46 29.46,19.94 25.65,16.13 24.89,16.13 U3.PIN6 | 33.78,29.08 31.5,31.37 30.86,31.37 U4.10
D+
  Top 0.127: JP3.1 61.98,8.89 62.61,8.89 U7.26
D-
  Top 0.127: JP3.2 56.39,1.78 57.4,1.78 58.04,2.41 58.04,3.68 62.1,7.75 62.23,7.75 62.61,8.13 U7.27
ESP32_EN
  Top 0.127: U9.P13 110.36,4.32 104.27,10.41 86.36,10.41 82.93,13.84 81.92,13.84 C12.2
ESP32_TCK
  Top 0.127: D2.TCK/SWDCLK 71.5,22.61 72.26,21.84 72.26,18.29 71.37,17.4 71.37,10.16 71.25,10.03 67.44,10.03 67.31,10.16 67.31,10.29 67.06,10.54 U7.20
ESP32_TDI
  Top 0.127: D2.TDI 69.6,20.07 68.33,18.8 68.33,14.22 67.82,13.72 67.82,10.67 U7.19
ESP32_TDO
  Top 0.127: D2.TDO/SWO 69.6,21.34 68.07,19.81 68.07,14.35 66.29,12.57 66.29,10.67 U7.21
ESP32_TMS
  Top 0.127: U7.18 68.58,14.99 72.01,18.41 72.01,21.72 71.75,21.97 68.96,21.97 68.71,22.23 68.71,22.99 69.6,23.88 D2.TMS/SWDIO
GND  (via drill 0.3)  (2 unrouted)
  Top 0.127: 37.21,22.1 37.21,18.03 C4.2 | 37.21,22.1 38.73,22.1 39.75,23.11 U5.2 43.18,23.11 43.56,23.5 43.56,24.77 46.23,27.43 47.5,27.43 48.26,26.67 C9.2 55.63,26.67 56.26,26.04 56.26,25.27 54.1,23.11 C10.2 48.26,23.11 47.5,23.88 45.59,23.88 44.45,22.73 44.07,22.73 43.81,22.48 43.81,16.51 | 37.21,22.1 C3.2 | 40.26,13.72 C5.2 | 42.04,15.49 40.26,13.72 | 40.26,13.72 42.04,11.94 42.04,11.68 C7.2 | 43.81,16.51 43.05,16.51 42.04,15.49 | 43.81,16.51 45.72,16.51 48.26,19.05 C11.1 64.01,19.05 64.64,19.68 | 42.04,15.49 C6.2 | JP2.2 54.74,9.02 53.72,9.02 52.07,10.67 48.77,10.67 U6.4 | U7.52 74.55,10.67 74.55,9.78 U7.11 74.42,9.78 72.52,9.78 | 72.52,9.78 72.14,10.16 72.14,10.29 71.88,10.54 U7.14 | U7.49_1 70.61,3.81 70.61,5.71 U7.49_8 70.61,5.84 70.61,7.62 U7.49_7 70.48,7.75 72.52,9.78 | 66.17,18.8 65.53,18.8 64.64,19.68 | 64.64,19.68 64.64,20.45 65.53,21.34 D2.GND@5 D2.GND@3 | 64.52,8.89 65.66,7.75 66.55,7.75 U7.49_5 66.67,7.62 66.67,5.84 U7.49_4 66.67,5.71 | 64.52,8.89 62.74,10.67 U7.51 62.61,10.79 62.48,10.92 JP2.2 | U7.49_6 U7.49_9 68.58,5.71 66.67,5.71 | 66.67,5.71 66.67,3.81 | 66.67,3.81 68.58,3.81 | 66.67,3.81 U7.49_3 | 66.17,18.8 66.17,12.83 65.79,12.45 65.79,10.16 64.52,8.89 | 66.17,18.8 D2.GND@9 | 68.58,3.81 70.48,3.81 U7.49_1 | 68.58,3.81 U7.49_2 | JP2.2 | 81.92,5.33 81.92,5.97 C13.2 | 81.92,5.33 81.92,2.03 C14.2 81.53,2.03 80.77,1.27 74.55,1.27 | U7.50 62.74,0.76 63.75,0.76 U7.36 63.88,0.89 64.52,0.89 U7.37 64.64,0.89 65.28,0.89 U7.38 65.41,0.89 66.17,0.89 U7.39 66.29,0.89 66.93,0.89 U7.40 67.06,0.89 67.69,0.89 U7.41 67.82,0.89 68.58,0.89 | 74.55,1.27 74.55,1.65 U7.1 74.55,1.78 74.55,2.54 U7.2
  Top 0.127: 74.55,1.27 74.55,0.89 U7.53 74.42,0.76 73.41,0.76 U7.48 73.28,0.89 72.64,0.89 U7.47 72.52,0.89 71.88,0.89 U7.46 71.75,0.89 70.99,0.89 U7.45 70.87,0.89 70.61,0.89 | 70.61,0.89 70.23,0.89 U7.44 70.1,0.89 69.47,0.89 U7.43 69.34,0.89 68.58,0.89 | 68.58,0.89 U7.42 | U9.P18 111.89,17.02 113.54,15.37 113.54,3.43 113.41,3.3 92.46,3.3 90.42,5.33 81.92,5.33 | 70.61,0.89 70.61,3.68 U7.49_1 | U8.P4 75.31,21.34 68.58,28.07 65.15,28.07 64.64,28.57 64.64,36.2 65.91,37.47 | D1.GND@9 65.91,37.47 | U9.P0 88.14,38.35 85.34,41.15 77.98,41.15 77.22,40.39 R12.1 76.07,40.39 74.17,42.29 66.93,42.29 D1.GND@3 D1.GND@5 65.53,40.39 64.64,39.5 | 65.91,37.47 64.64,38.73 64.64,39.5 | X3.2 X3.1 4.57,9.65 9.91,9.65 15.49,15.24 | U3.PIN1 U3.PIN2 24.89,18.54 25.65,18.54 25.91,18.29 25.91,17.65 25.65,17.4 24.89,17.4 U3.PIN4 U3.PIN5 24.89,16.64 24.13,16.64 23.88,16.38 23.88,15.11 | 23.88,15.11 24.13,14.86 24.89,14.86 U3.PIN8 | v32,32.77 30.86,32.77 U4.12 | v30.86,35.94 30.86,35.31 U4.16 | 15.49,15.24 15.49,16.26 16,16.76 16.51,16.76 17.53,17.78 17.53,18.8 15.75,20.57 15.75,23.62 15.24,24.13 14.73,24.13 U1.2 | 15.49,15.24 16,14.73 18.03,14.73 JP1.5 | v23.75,15.11 23.88,15.11 | 64.64,39.5 51.44,39.5 48.51,42.42 X4.2
  Bottom 0.127: JP1.5 21.59,15.75 | 48.51,40.03 X4.2 | G101.N2 74.8,41.91 61.85,41.91 G101.N1 | 39.62,12.83 54.48,12.83 56.26,11.05 56.64,11.05 JP2.2
  Bottom 0.254: G101.N1 55.94,41.91 54.06,40.03 48.51,40.03 39.27,40.03 39.12,39.88
  pour Bottom: 11.68,45.72 39.62,45.72 39.62,12.19 21.59,12.19 21.59,21.59 11.68,21.59
I+  (via drill 0.3)
  Top 0.127: v18.29,24.77 17.4,24.77 U1.8 | R1.2 16.89,28.7 16.89,30.73 17.65,31.5 17.65,33.15 17.53,33.27 16.26,33.27 15.88,32.89 15.88,31.88 10.16,26.16 4.57,26.16 X2.1
  Bottom 0.127: v18.29,24.77 18.29,21.97 14.99,18.67 14.99,16.76 14.48,16.26 | 14.48,16.26 4.57,26.16 X2.1 | 14.48,16.26 JP1.1
I-
  Top 0.127: RSENSE.2 16.76,32.51 16.76,30.99 15.24,29.46 15.24,28.7 R1.1 15.11,28.7 14.73,28.32 14.73,24.89 U1.1 14.61,24.77 14.22,24.77 10.67,21.21 4.57,21.21 X2.2
IO9/BOOT
  Top 0.127: U7.23 64.52,10.67 64.26,10.92 64.26,11.05 62.48,12.83 55.88,12.83 54.1,11.05 JP2.1
N$4
  Top 0.127: R2.1 22.99,42.67 21.34,41.02 19.05,41.02 | 19.05,41.02 19.05,39.75 U2.6 | 19.05,41.02 U2.7
N$7
  Top 0.127: C8.1 44.58,7.87 48.64,11.94 48.64,12.57 U6.5
N$8
  Top 0.127: R3.1 20.19,38.86 19.81,39.24 16.13,39.24 14.35,41.02 14.1,41.02 | 14.1,41.02 14.1,42.29 U2.1 | 14.1,41.02 U2.2
N$10
  Top 0.127: C8.2 42.42,7.87 45.21,10.67 46.23,10.67 U6.3
N$16
  Bottom 0.127: G100.P1 110.49,5.08 G102.N1 97.41,5.08 | G100.P2 97.41,5.08 | 97.41,5.08 G102.N2
N$17
  Bottom 0.127: G103.P1 61.72,17.4 G100.N1 61.85,17.4 74.8,17.4 | 74.8,17.4 G103.P2 | 74.8,17.4 G100.N2
N$18
  Bottom 0.127: G101.P1 110.49,29.72 G103.N1 110.36,29.72 97.41,29.72 | G101.P2 97.41,29.72 | 97.41,29.72 G103.N2
N$21
  Top 0.127: U7.22 65.41,10.67 65.41,13.97 R10.1
N$24
  Top 0.127: 75.18,13.59 75.18,7.87 75.06,7.75 74.93,7.75 74.55,7.37 U7.8 | 75.18,13.59 74.8,13.97 R11.1 75.18,13.59 | 75.18,13.59 75.44,13.84 80.14,13.84 C12.1
N$25
  Top 0.127: U7.5 74.55,4.95 75.18,4.95 80.14,9.91 R14.1
N$29
  Top 0.127: R7.1 R3.2 26.16,38.86 26.16,35.05 25.78,34.67 25.15,34.67 U4.2
N$30
  Top 0.127: R2.2 R6.1 29.72,42.67 30.35,42.04 30.35,38.23 26.16,34.04 25.15,34.04 U4.3
N$33
  Top 0.127: R9.1 R5.2 26.16,23.37 25.53,24 25.53,27.56 23.75,29.34 23.75,31.37 24.38,32 25.02,32 U4.6
N$36
  Top 0.127: R8.1 R4.2 26.16,27.18 26.16,30.99 25.78,31.37 25.15,31.37 U4.7
N$37
  Top 0.127: U1.5 17.4,22.99 24.13,22.99 24.51,23.37 R5.1
N$48
  Top 0.127: RSENSE.1 15.24,32.51 15.62,32.89 15.62,33.02 16.13,33.53 17.65,33.53 17.91,33.27 17.91,26.54 16,24.64 16,21.34 JP1.6 JP1.3
POWERDOWN  (via drill 0.3)
  Top 0.127: v19.43,23.88 19.18,23.62 17.4,23.62 U1.6 | v20.45,24.89 20.45,28.7 24.38,32.64 | 24.38,32.64 25.02,32.64 U4.5 24.38,32.64 | v37.72,21.21 38.23,21.21 39.12,22.1 42.16,22.1 U5.3 | 24.38,32.64 24,33.02 24,34.92 24.26,35.18 25.02,35.18 U4.1 | v90.68,1.78 U9.P12
  Bottom 0.127: v19.43,23.88 v20.45,24.89 21.97,23.37 31.62,23.37 | v37.72,21.21 35.56,23.37 31.62,23.37 | v90.68,1.78 46.99,1.78 31.62,17.14 31.62,23.37
REF+1V65  (via drill 0.3)
  Top 0.127: v45.47,23.11 C10.1 | v43.05,23.62 42.67,23.62 42.29,24 U5.1 | v47.37,21.21 55.37,21.21 REF+1V65.TP | v15.24,22.23 15.49,22.48 15.49,23.24 15.24,23.5 14.73,23.5 U1.3 | v16.51,22.23 16.51,23.88 16.76,24.13 17.27,24.13 U1.7 17.4,24.26 18.41,24.26 18.54,24.38 20.57,24.38 23.37,27.18 R4.1 24.64,27.18 25.27,26.54 25.27,22.99 25.65,22.61 30.23,22.61 30.35,22.73 30.35,28.7 25.78,33.27 25.15,33.27 U4.4 | v24.26,29.97 25.02,30.73 U4.8
  Bottom 0.127: v47.37,21.21 v45.47,23.11 43.56,23.11 v43.05,23.62 30.61,23.62 v24.26,29.97 19.68,25.4 18.29,25.4 16.51,23.62 v16.51,22.23 v15.24,22.23
REF+3V3
  Top 0.127: U3.PIN9 30.73,14.73 31.75,13.72 C5.1 35.56,13.72 35.56,14.35 43.56,22.35 43.56,22.99 44.58,24 U5.5 44.7,24.13 46.86,26.29 | 46.86,26.29 46.86,26.67 C9.1 46.86,26.29 | REF+3V3.TP 47.5,25.65 46.86,26.29
SCL  (via drill 0.3)
  Top 0.127: U8.P6 81.66,22.61 73.79,14.73 73.79,13.34 v72.64,12.19 72.64,10.67 U7.13 | v33.4,19.3 U3.PIN16 | U9.P1 87.38,27.18 v84.96,24.77
  Bottom 0.127: v33.4,19.3 56.39,19.3 63.5,12.19 v72.64,12.19 74.55,12.19 77.09,14.73 77.09,15.24 84.96,23.11 v84.96,24.77
SDA  (via drill 0.3)
  Top 0.127: U8.P5 80.77,21.34 74.04,14.61 74.04,13.21 73.41,12.57 v73.41,11.68 73.41,10.67 U7.12 | v33.4,18.67 30.73,18.67 U3.PIN15 | U9.P2 87.12,24.64 v85.09,22.61
  Bottom 0.127: v33.4,18.67 56.64,18.67 63.63,11.68 v73.41,11.68 74.42,11.68 85.09,22.35 v85.09,22.61
SDI_DATA  (via drill 0.3)
  Top 0.127: U9.P11 v89.41,3.05
  Bottom 0.127: v89.41,3.05 92.08,5.71 92.08,29.84 77.22,44.7 61.09,44.7 58.93,42.55 53.59,42.55 X4.1
STM_SWDCLK  (via drill 0.3)
  Top 0.127: D1.TCK/SWDCLK 74.42,41.66 78.36,37.72 v83.57,37.72 | v91.57,19.05 107.31,19.05 110.36,22.1 U9.P20
  Bottom 0.127: v83.57,37.72 83.82,37.47 83.95,37.47 91.57,29.84 v91.57,19.05
STM_SWDIO
  Top 0.127: D1.TMS/SWDIO 101.22,42.93 113.54,30.61 113.54,26.29 111.89,24.64 U9.P21
STM_SWO
  Top 0.127: D1.TDO/SWO 71.12,40.39 84.45,27.05 84.45,22.48 87.38,19.56 U9.P4
V+
  Top 0.127: U2.3 7.37,39.75 4.57,42.55 X1.1
  Bottom 0.127: JP1.2 13.97,18.8 6.99,25.78 6.99,40.13 4.57,42.55 X1.1
V-
  Top 0.127: U2.5 15.62,38.48 15.11,38.99 5.84,38.99 4.57,37.72 X1.2 4.57,37.59 2.16,35.18 2.16,20.57 2.92,19.81 13.97,19.81 15.49,18.29 JP1.4
VBAT  (via drill 0.3)
  Top 0.127: VBAT.TP 67.94,32.77 v68.07,32.64
  Bottom 0.127: G102.P1 G102.P2 74.8,11.68 85.6,22.48 85.6,27.69 80.64,32.64 | 80.64,32.64 v68.07,32.64 | JP4.3 80.64,32.64
VBAT/2  (via drill 0.3)
  Top 0.127: R12.2 R13.1 83.06,40.39 v84.2,39.24 | v109.86,8.13 111.12,6.86 U9.P14
  Bottom 0.127: v84.2,39.24 84.2,38.1 95.12,27.18 95.12,24.51 109.86,9.78 v109.86,8.13
VCC  (via drill 0.3)
  Top 0.127: R13.2 84.71,40.39 84.71,34.42 83.95,33.66 82.93,33.66 JP4.2 79.12,37.47 78.23,37.47 74.68,41.02 68.96,41.02 68.71,40.77 68.71,32.64 65.53,29.46 VCC.TP | 46.1,20.7 44.7,22.1 U5.4 | 46.1,20.7 46.86,19.94 46.86,19.05 C11.2 | 46.1,20.7 47.75,22.35 53.72,22.35 56.52,25.15 v56.52,29.46 43.56,42.42 X4.3
  Bottom 0.127: JP4.2 80.77,35.56 78.36,33.15 60.2,33.15 v56.52,29.46
VOLTAGE_N
  Top 0.127: 31.88,34.92 31.75,34.92 31.5,34.67 30.86,34.67 U4.15 | 31.88,34.92 34.54,34.92 | 31.88,34.92 31.88,35.56 31.37,36.07 31.37,38.86 R7.2 | 34.54,34.92 34.54,33.53 35.56,32.51 35.56,29.08 34.42,27.94 34.42,18.54 32,16.13 30.73,16.13 U3.PIN11 | 34.54,34.92 C1.1
VOLTAGE_P
  Top 0.127: 32.51,41.53 31.37,42.67 R6.2 | 32.51,41.53 34.54,39.5 C1.2 34.54,36.58 35.31,35.81 35.31,33.15 35.81,32.64 35.81,28.96 34.67,27.81 34.67,18.41 31.75,15.49 30.73,15.49 U3.PIN10 | 32.51,41.53 30.61,39.62 30.61,38.1 29.72,37.21 29.72,34.42 30.1,34.04 30.73,34.04 U4.14
VUSB  (via drill 0.3)
  Top 0.127: v74.42,35.56 VUSB.TP | U9.P23 91.44,29.72 90.42,28.7 85.34,28.7 JP4.1
  Bottom 0.127: JP4.1 v74.42,35.56

### Text on the board
tPlace: Vcc | GND | DATA | GND | SPS | John Madden / UC Santa Cruz